# EAGLE design 7segement4digits1badidea-many-digits-mk-2.2 (EAGLE 6.5.0)
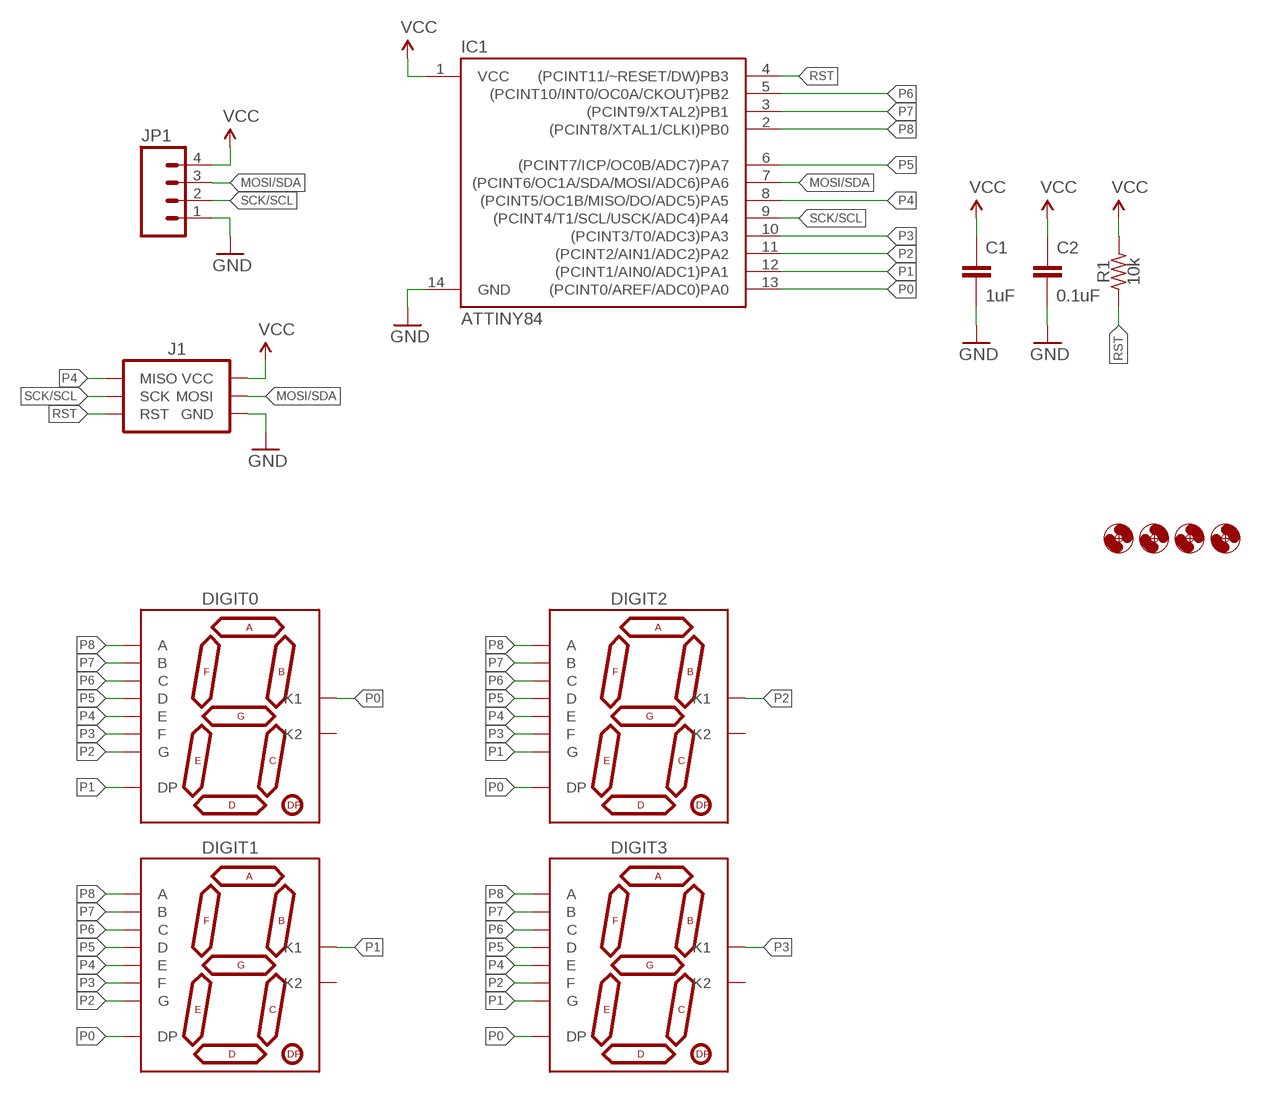
[diagram p0: schematic, sheet 1]

## Parts
C1  1uF  CAPACITOR-CERAMICC0805  [C0805]
C2  0.1uF  CAPACITOR-CERAMICC0603  [C0603]
DIGIT0  7SEG_1DIGPTH-25.4MM  [7SEG_1DIG_25.4MM]
DIGIT1  7SEG_1DIGPTH-25.4MM  [7SEG_1DIG_25.4MM]
DIGIT2  7SEG_1DIGPTH-25.4MM  [7SEG_1DIG_25.4MM]
DIGIT3  7SEG_1DIGPTH-25.4MM  [7SEG_1DIG_25.4MM]
H1  HOLE#2  [HOLE-#2]
H2  HOLE#2  [HOLE-#2]
H3  HOLE#2  [HOLE-#2]
H4  HOLE#2  [HOLE-#2]
IC1  ATTINY84  [SO14]
J1  AVR_SPI_PRG_6PTH  [2X3]
JP1  M04PTH  [1X04-PTH-VERT]
R1  10k  RESISTORR0603  [R0603]

## Nets
GND: C1.2 C2.2 IC1.14(GND) J1.6(GND) JP1.1
MOSI/SDA: IC1.7((PCINT6/OC1A/SDA/MOSI/ADC6)PA6) J1.4(MOSI) JP1.3
P0: DIGIT0.3(K1) DIGIT1.5(DP) DIGIT2.5(DP) DIGIT3.5(DP) IC1.13((PCINT0/AREF/ADC0)PA0)
P1: DIGIT0.5(DP) DIGIT1.3(K1) DIGIT2.10(G) DIGIT3.10(G) IC1.12((PCINT1/AIN0/ADC1)PA1)
P2: DIGIT0.10(G) DIGIT1.10(G) DIGIT2.3(K1) DIGIT3.9(F) IC1.11((PCINT2/AIN1/ADC2)PA2)
P3: DIGIT0.9(F) DIGIT1.9(F) DIGIT2.9(F) DIGIT3.3(K1) IC1.10((PCINT3/T0/ADC3)PA3)
P4: DIGIT0.1(E) DIGIT1.1(E) DIGIT2.1(E) DIGIT3.1(E) IC1.8((PCINT5/OC1B/MISO/DO/ADC5)PA5) J1.1(MISO)
P5: DIGIT0.2(D) DIGIT1.2(D) DIGIT2.2(D) DIGIT3.2(D) IC1.6((PCINT7/ICP/OC0B/ADC7)PA7)
P6: DIGIT0.4(C) DIGIT1.4(C) DIGIT2.4(C) DIGIT3.4(C) IC1.5((PCINT10/INT0/OC0A/CKOUT)PB2)
P7: DIGIT0.6(B) DIGIT1.6(B) DIGIT2.6(B) DIGIT3.6(B) IC1.3((PCINT9/XTAL2)PB1)
P8: DIGIT0.7(A) DIGIT1.7(A) DIGIT2.7(A) DIGIT3.7(A) IC1.2((PCINT8/XTAL1/CLKI)PB0)
RST: IC1.4((PCINT11/~RESET/DW)PB3) J1.5(RST) R1.1
SCK/SCL: IC1.9((PCINT4/T1/SCL/USCK/ADC4)PA4) J1.3(SCK) JP1.2
VCC: C1.1 C2.1 IC1.1(VCC) J1.2(VCC) JP1.4 R1.2
Unconnected: DIGIT0.8(K2) DIGIT1.8(K2) DIGIT2.8(K2) DIGIT3.8(K2)

## Library data of the parts
C1 C2 = A_butts:CAPACITOR-CERAMIC: CAPACITOR, European symbol
DIGIT0 DIGIT1-DIGIT3 = A_butts:7SEG_1DIG
H1-H4 = A_butts:HOLE: MOUNTING HOLE with drill center marker
IC1 = A_butts:ATTINY84: Atmel 14-pin 2/4/8kB flash uC
J1 = A_butts:AVR_SPI_PRG_6: AVR ISP 6 Pin This is the reduced ISP connector for AVR programming. Common on Arduino. This footprint will take up less PCB space and can be used with a 10-pin to 6-pin adapter such as SKU: BOB-08508 **Special note about "TEST_POINT" package. The stop mask is on the top side, so if you want your programming test points to be on the bottom of your board, make sure to place this package on the bottom side of the board. This also ensure that the orientation to program from the bottom side will be correct.
JP1 = A_butts:M04: Header 4 Standard 4-pin 0.1" header. Use with straight break away headers (SKU : PRT-00116), right angle break away headers (PRT-00553), swiss pins (PRT-00743), machine pins (PRT-00117), and female headers (PRT-00115). Molex polarized connector foot print use with SKU : PRT-08231 with associated crimp pins and housings. 1MM SMD Version SKU: PRT-10208
R1 = A_butts:RESISTOR: RESISTOR, American symbol

## Board
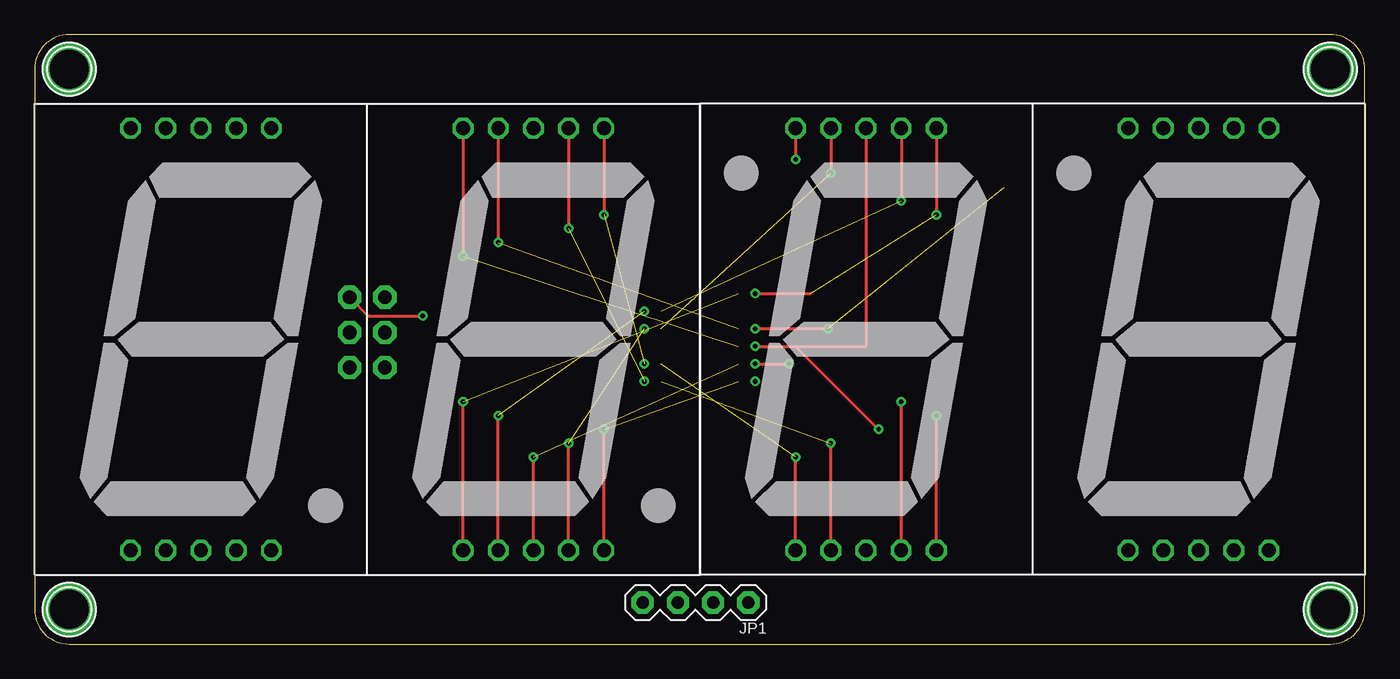
[diagram p1: board, top side]
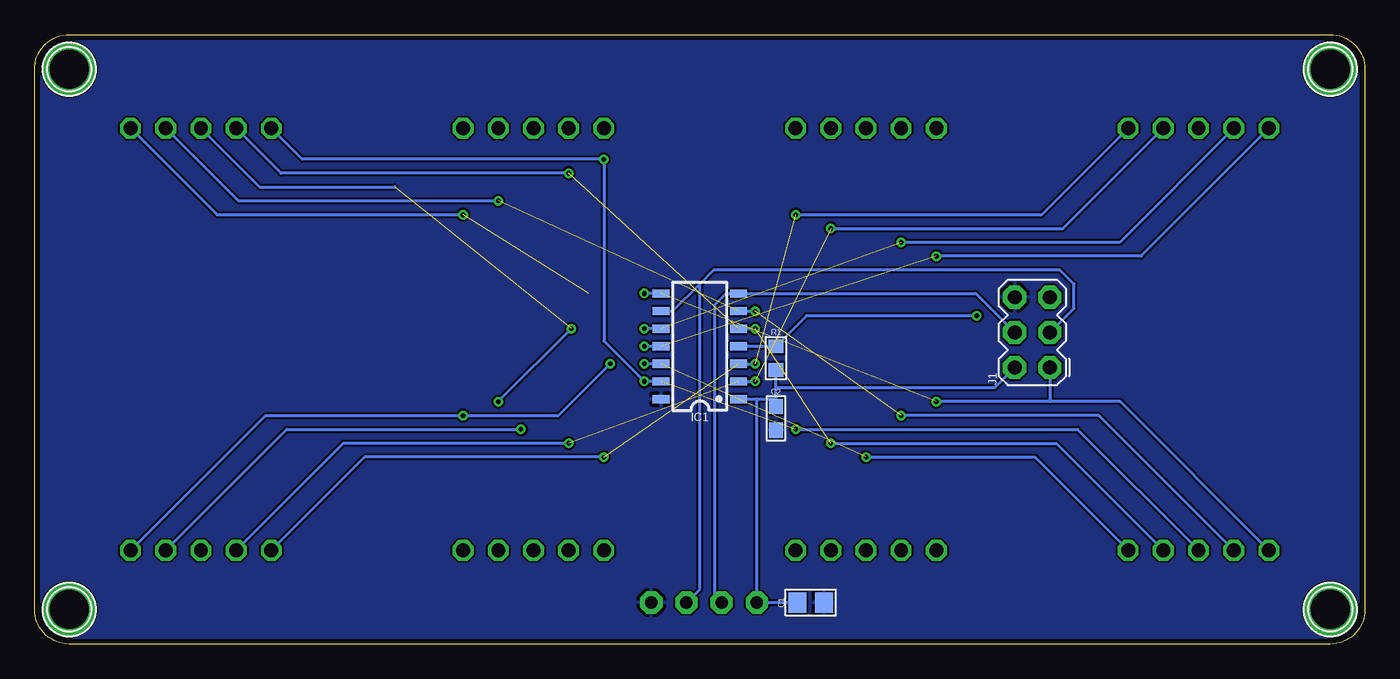
[diagram p2: board, bottom side, seen from below]

Size 96 x 44 mm. Coordinates in mm from the lower left corner, seen from the top.
Outline: 2.5,0 93.5,0 arc90 96,2.5 96,41.5 arc90 93.5,44 2.5,44 arc90 0,41.5 0,2.5 arc90 2.5,0
Copper layers (1*16): Top 0.0356mm / dielectric 1.5011mm / Bottom 0.0356mm
Design rules "LaenPCBOrder_2": minimum track width 6mil, minimum drill 13mil, track to track 6mil, track to pad 6mil, pad to pad 6mil, via to via 6mil, smd to smd 6mil, copper to edge 15mil, drill to drill 6mil, minimum pad ring 7mil, minimum via ring 7mil, stop-mask expansion 3mil, vias tented up to drill 20mil, thermal gap 10mil

### Footprints (pad centres in the part's own frame; a part is rotated, then mirrored left to right if it is on the bottom)
C0805 = smd 1.3 x 1.5: 1 -0.95,0; 2 0.95,0
C0603 = smd 1.1 x 1: 1 -0.85,0; 2 0.85,0
7SEG_1DIG_25.4MM = drill 1 pad 1.5 octagon: 1 -5.08,-15.24; 2 -2.54,-15.24; 3 0,-15.24; 4 2.54,-15.24; 5 5.08,-15.24; 6 5.08,15.24; 7 2.54,15.24; 8 0,15.24; 9 -2.54,15.24; 10 -5.08,15.24
HOLE-#2 = drill 2.8 pad 3.81: P$1 0,0
SO14 = smd 0.6 x 1.2: 1 -3.81,-2.8; 2 -2.54,-2.8; 3 -1.27,-2.8; 4 0,-2.8; 5 1.27,-2.8; 6 2.54,-2.8; 7 3.81,-2.8; 8 3.81,2.8; 9 2.54,2.8; 10 1.27,2.8; 11 0,2.8; 12 -1.27,2.8; 13 -2.54,2.8; 14 -3.81,2.8
2X3 = drill 1 pad 1.676 octagon: 1 -2.54,-1.27; 2 -2.54,1.27; 3 0,-1.27; 4 0,1.27; 5 2.54,-1.27; 6 2.54,1.27
1X04-PTH-VERT = drill 0.9 pad 1.6 octagon: 1 0,0; 2 2.54,0; 3 5.08,0; 4 7.62,0
R0603 = smd 1 x 1.1: 1 -0.85,0; 2 0.85,0

### Placement (x,y rotation side)
C1  40,3 0 bottom
C2  42.5,16.3 270 bottom
DIGIT0  12,22 0 top
DIGIT1  36,22 0 top
DIGIT2  60,22 180 top
DIGIT3  84,22 180 top
H1  2.5,2.5 0 top
H2  2.5,41.5 0 top
H3  93.5,41.5 0 top
H4  93.5,2.5 0 top
IC1  48,21.5 90 bottom
J1  24,22.5 90 bottom
JP1  51.5,3 180 top
R1  42.5,20.65 270 bottom

### Tracks (layer width: path | path; a pad name or v marks a point on that pad's centre or on a via)
GND
  pour Bottom: 0,0 0,44 96,44 96,0
MOSI/SDA
  Bottom 0.2: J1.4 28.08,25.31 IC1.7 46.09,25.31 46.92,24.48 46.92,3.5 JP1.3
P0  (via drill 0.33)  (1 unrouted)
  Top 0.2: DIGIT2.5 v54.92,35 | DIGIT1.5 v41.08,15.5
  Bottom 0.2: DIGIT0.3 20.74,15.5 v41.08,15.5 | DIGIT3.5 76.68,35 v54.92,35 54.92,21.88 v52,18.96 IC1.13
P1  (via drill 0.33)  (1 unrouted)
  Top 0.2: DIGIT2.10 v65.08,16.5 | DIGIT1.3 v36,13.5 | v52,20.23 v54.47,20.23
  Bottom 0.2: DIGIT0.5 23.82,13.5 v36,13.5 | DIGIT3.10 79.34,16.5 v65.08,16.5 58.2,16.5 v54.47,20.23 | IC1.12 v52,20.23
P2  (via drill 0.33)  (1 unrouted)
  Top 0.2: DIGIT1.10 v30.92,28 | v52,21.5 54.9,21.5 | 54.9,21.5 60,21.5 DIGIT2.3 | v60.9,15.5 54.9,21.5
  Bottom 0.2: DIGIT0.10 16.16,28 v30.92,28 | DIGIT3.9 77.8,15.5 v60.9,15.5 | IC1.11 v52,21.5
P3  (via drill 0.33)  (2 unrouted)
  Top 0.2: DIGIT2.9 v62.54,17.5 | DIGIT1.9 v33.46,29 | v52,22.77 v57.27,22.77
  Bottom 0.2: DIGIT0.9 17.7,29 v33.46,29 | DIGIT3.3 79.76,33 70,33 | IC1.10 v52,22.77 | v57.27,22.77 v62.54,17.5
P4  (via drill 0.33)  (2 unrouted)
  Top 0.2: DIGIT2.1 v65.08,31 | DIGIT1.1 v30.92,17.5 | v52,25.31 56,25.31
  Bottom 0.2: DIGIT0.1 17.66,17.5 22.73,17.5 | 22.73,17.5 v30.92,17.5 | J1.1 22.73,17.5 | DIGIT3.1 82.84,31 v65.08,31 | IC1.8 v52,25.31
P5  (via drill 0.33)  (2 unrouted)
  Top 0.2: DIGIT2.2 v62.54,32 | DIGIT1.2 v33.46,16.5
  Bottom 0.2: IC1.6 v44,24.04 | DIGIT0.2 19.2,16.5 v33.46,16.5 | DIGIT3.2 81.3,32 v62.54,32
P6  (via drill 0.33)  (2 unrouted)
  Top 0.2: DIGIT2.4 v57.46,34 | DIGIT1.4 v38.54,14.5
  Bottom 0.2: IC1.5 v44,22.77 | DIGIT0.4 22.28,14.5 v38.54,14.5 | DIGIT3.4 78.22,34 v57.46,34
P7  (via drill 0.33)  (2 unrouted)
  Top 0.2: DIGIT2.6 v54.92,13.5 | DIGIT1.6 v41.08,31
  Bottom 0.2: DIGIT0.6 23.32,31 v41.08,31 | DIGIT3.6 72.18,13.5 v54.92,13.5 | IC1.3 v44,20.23
P8  (via drill 0.33)  (2 unrouted)
  Top 0.2: DIGIT2.7 v57.46,14.5 | DIGIT1.7 v38.54,30
  Bottom 0.2: DIGIT0.7 21.78,30 v38.54,30 | DIGIT3.7 73.72,14.5 v57.46,14.5 | IC1.2 v44,18.96
RST  (via drill 0.33)
  Top 0.2: J1.5 24.07,23.7 v28,23.7
  Bottom 0.2: v28,23.7 40.3,23.7 R1.1 IC1.4
SCK/SCL
  Bottom 0.2: J1.3 21,24.23 21,26 22,27 47,27 48,26 | 48,26 50,24 50.76,24 IC1.9 | JP1.2 48,3.96 48,26
VCC
  Bottom 0.2: C1.1 JP1.4 43.88,17.69 | C2.1 42.5,17.69 | 42.5,17.69 42.5,18.5 | 42.5,18.5 R1.2 | IC1.1 43.9,17.69 43.88,17.69 | 43.88,17.69 42.5,17.69 | J1.2 26.73,18.5 42.5,18.5